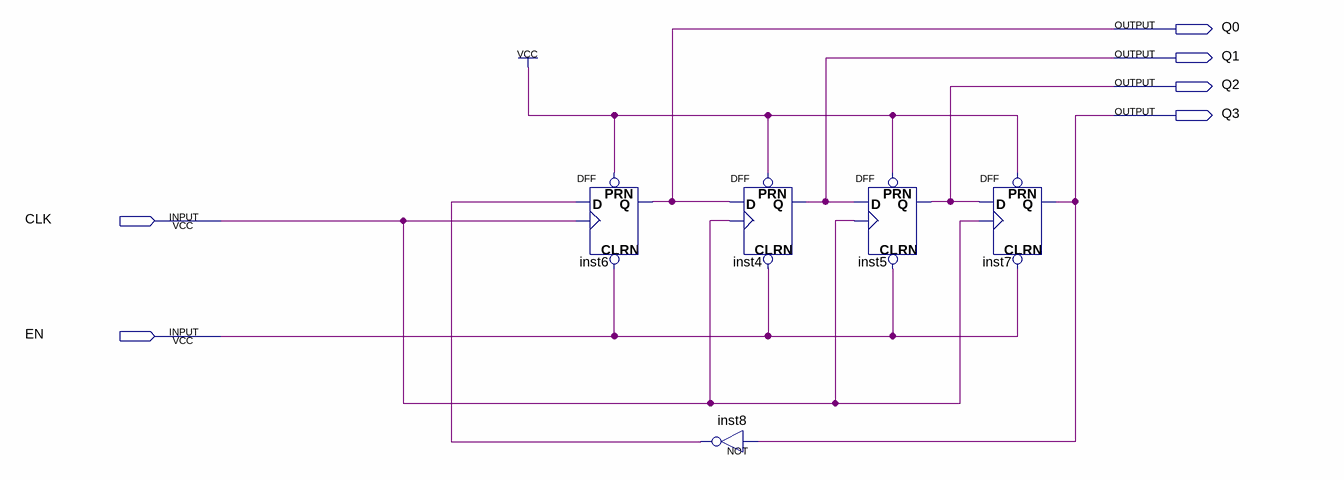
[diagram p0: schematic sheet]
// Quartus schematic Johnson.bdf as structural Verilog: 5 symbols, 6 pins
module Johnson (
  input  CLK,
  input  EN,
  output Q0,
  output Q1,
  output Q2,
  output Q3
);

  wire inst8_out;

  DFF inst6 (.CLRN(EN), .CLK(CLK), .D(inst8_out), .PRN(1'b1), .Q(Q0));
  DFF inst4 (.CLRN(EN), .CLK(CLK), .D(Q0), .PRN(1'b1), .Q(Q1));
  not inst8 (inst8_out, Q3);
  DFF inst5 (.CLRN(EN), .CLK(CLK), .D(Q1), .PRN(1'b1), .Q(Q2));
  DFF inst7 (.CLRN(EN), .CLK(CLK), .D(Q2), .PRN(1'b1), .Q(Q3));
endmodule
